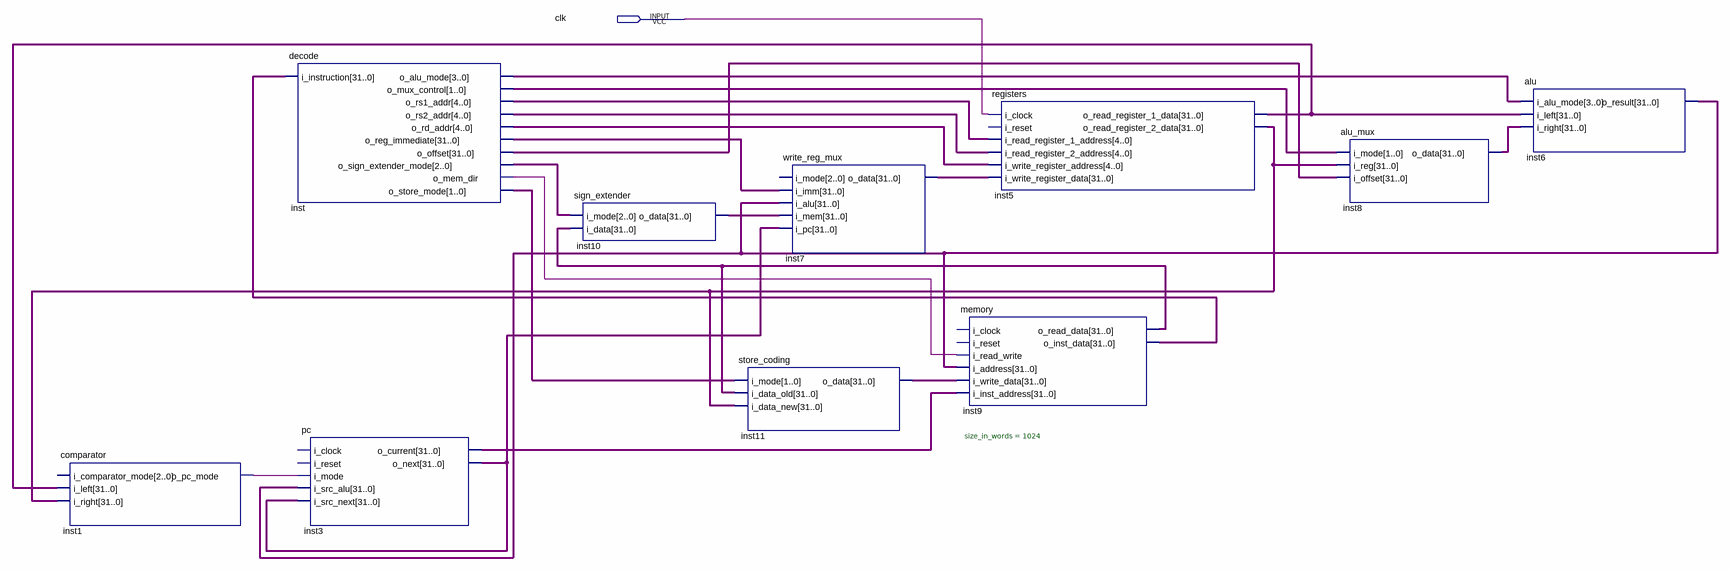
[diagram p0: schematic sheet]
// Quartus schematic Riscv.bdf as structural Verilog: 10 symbols, 1 pins
module Riscv (
  input  clk
);

  wire inst1_o_pc_mode, inst_o_mem_dir;
  wire [1:0] inst_o_mux_control, inst_o_store_mode;
  wire [2:0] inst_o_sign_extender_mode;
  wire [3:0] inst_o_alu_mode;
  wire [4:0] inst_o_rd_addr, inst_o_rs1_addr, inst_o_rs2_addr;
  wire [31:0] inst3_o_current, inst3_o_next, inst5_o_read_register_1_data, inst5_o_read_register_2_data,
       inst6_o_result, inst7_o_data, inst8_o_data, inst9_o_inst_data, inst9_o_read_data, inst10_o_data,
       inst11_o_data, inst_o_offset, inst_o_reg_immediate;

  comparator inst1 (
    .i_left(inst5_o_read_register_1_data), .i_right(inst5_o_read_register_2_data), .o_pc_mode(inst1_o_pc_mode));  // open: i_comparator_mode
  decode inst (
    .i_instruction(inst9_o_inst_data), .o_alu_mode(inst_o_alu_mode), .o_mux_control(inst_o_mux_control),
    .o_rs1_addr(inst_o_rs1_addr), .o_rs2_addr(inst_o_rs2_addr), .o_rd_addr(inst_o_rd_addr),
    .o_reg_immediate(inst_o_reg_immediate), .o_offset(inst_o_offset),
    .o_sign_extender_mode(inst_o_sign_extender_mode), .o_mem_dir(inst_o_mem_dir),
    .o_store_mode(inst_o_store_mode));
  pc inst3 (
    .i_mode(inst1_o_pc_mode), .i_src_alu(inst6_o_result), .i_src_next(inst3_o_next),
    .o_current(inst3_o_current), .o_next(inst3_o_next));  // open: i_clock, i_reset
  sign_extender inst10 (.i_mode(inst_o_sign_extender_mode), .i_data(inst9_o_read_data), .o_data(inst10_o_data));
  store_coding inst11 (
    .i_mode(inst_o_store_mode), .i_data_old(inst9_o_read_data), .i_data_new(inst5_o_read_register_2_data),
    .o_data(inst11_o_data));
  write_reg_mux inst7 (
    .i_imm(inst_o_reg_immediate), .i_alu(inst6_o_result), .i_mem(inst10_o_data), .i_pc(inst3_o_next),
    .o_data(inst7_o_data));  // open: i_mode
  registers inst5 (
    .i_clock(clk), .i_read_register_1_address(inst_o_rs1_addr), .i_read_register_2_address(inst_o_rs2_addr),
    .i_write_register_address(inst_o_rd_addr), .i_write_register_data(inst7_o_data),
    .o_read_register_1_data(inst5_o_read_register_1_data),
    .o_read_register_2_data(inst5_o_read_register_2_data));  // open: i_reset
  memory #(.size_in_words(1024)) inst9 (
    .i_read_write(inst_o_mem_dir), .i_address(inst6_o_result), .i_write_data(inst11_o_data),
    .i_inst_address(inst3_o_current), .o_read_data(inst9_o_read_data), .o_inst_data(inst9_o_inst_data));  // open: i_clock, i_reset
  alu_mux inst8 (
    .i_mode(inst_o_mux_control), .i_reg(inst5_o_read_register_2_data), .i_offset(inst_o_offset),
    .o_data(inst8_o_data));
  alu inst6 (
    .i_alu_mode(inst_o_alu_mode), .i_left(inst5_o_read_register_1_data), .i_right(inst8_o_data),
    .o_result(inst6_o_result));
endmodule
